# EAGLE design Addon-mapleCUx_Raspi-3V3-UART-Adapter-008 (EAGLE 7.6.0)
MAPLE-CUx Large Version
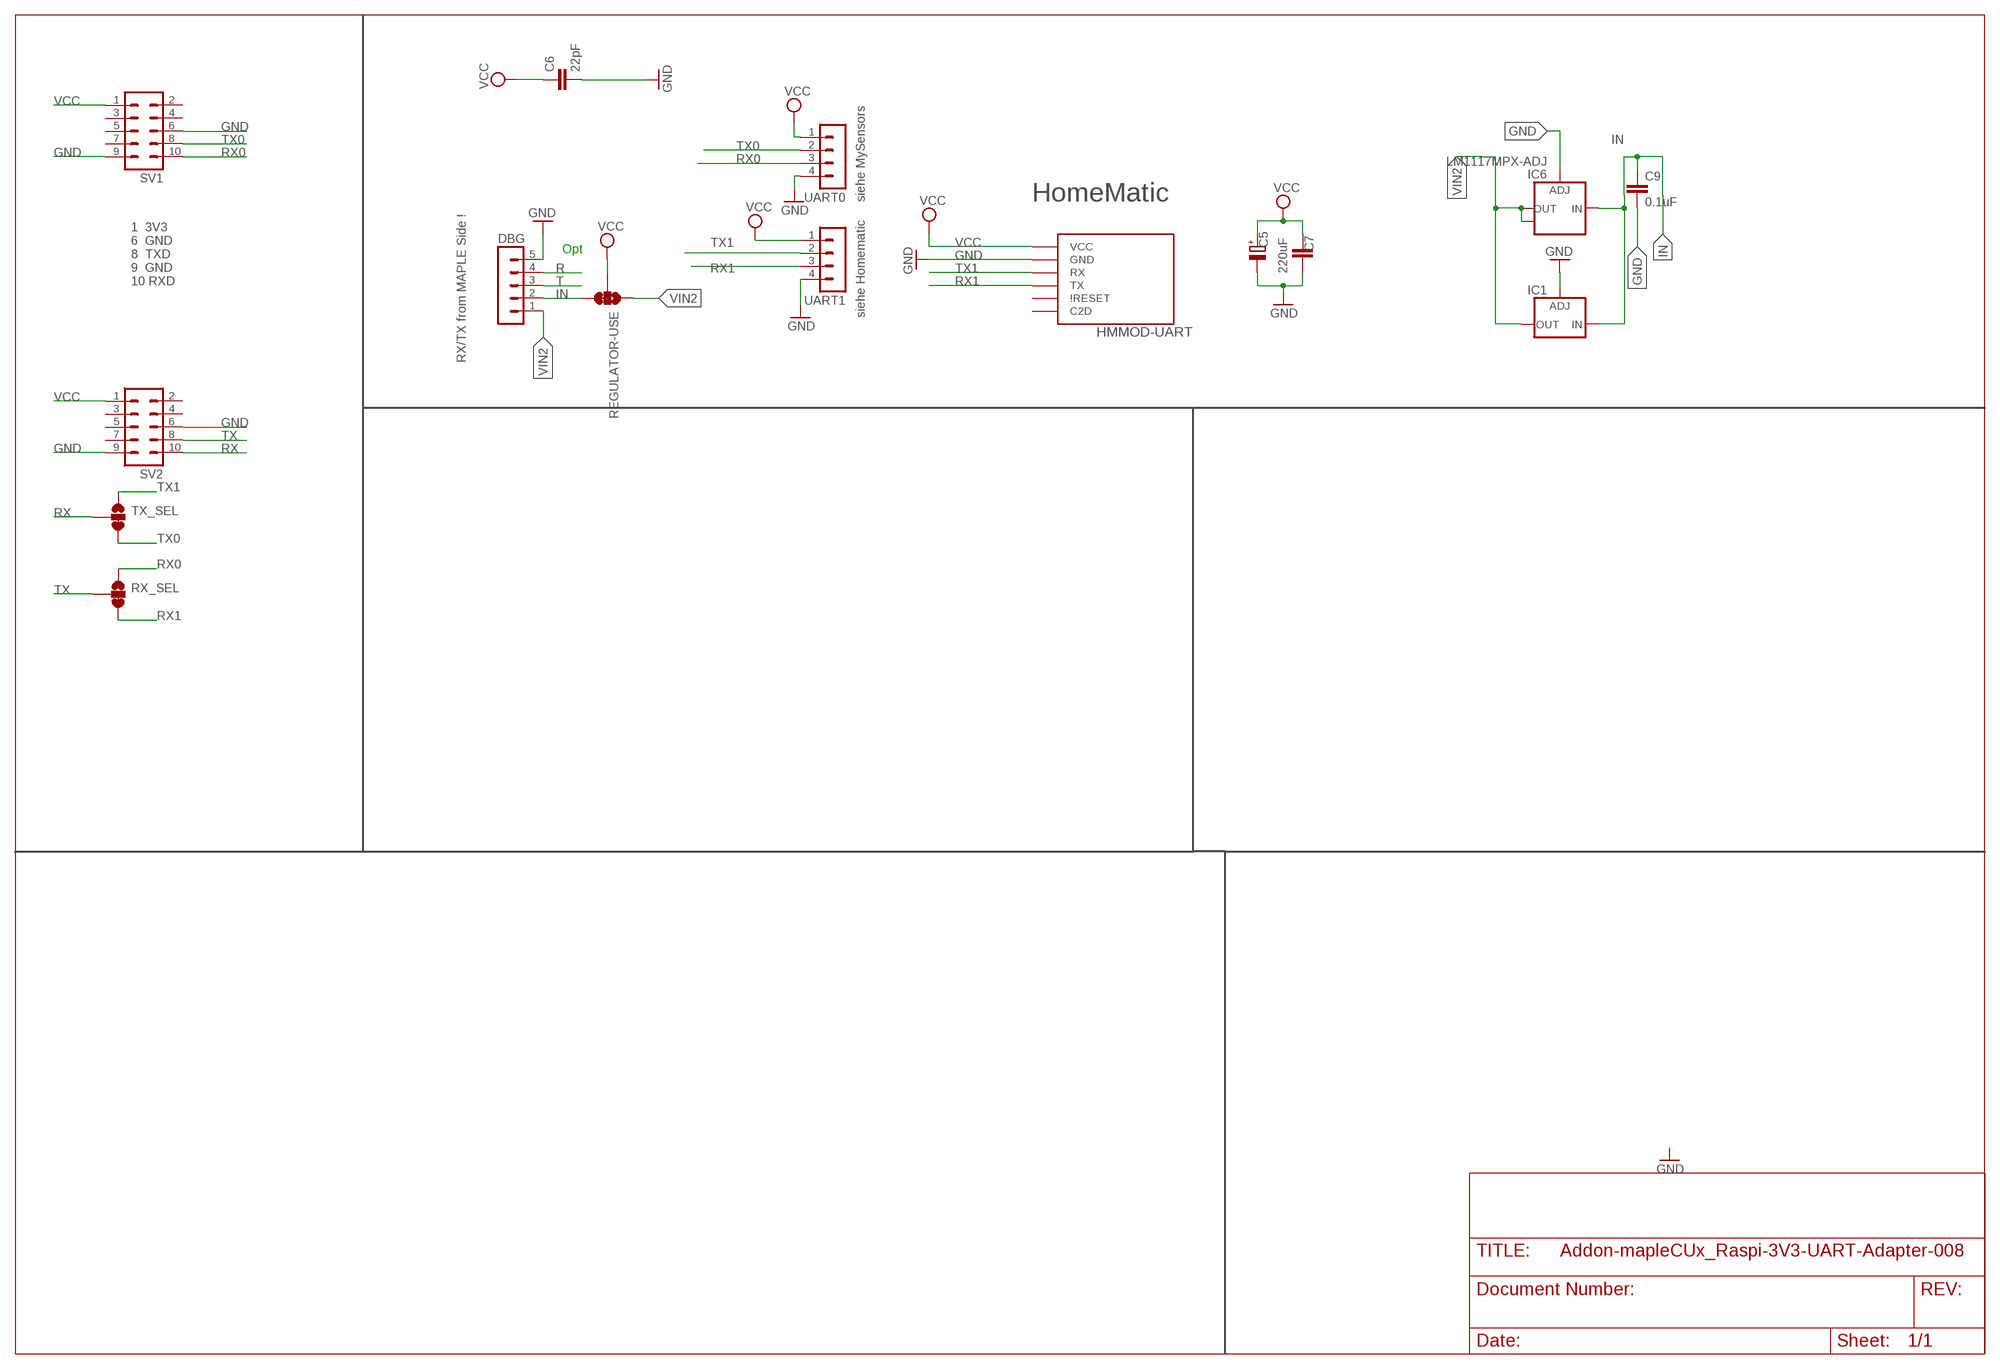
[diagram p0: schematic, sheet 1]

## Parts
C5  220uF  CPOL-EUE5-8.5  [E5-8,5]
C6  22pF  C-EUC0805  [C0805]
C7  C-EUC1812  [C1812]
C9  0.1uF  C-EUC1206  [C1206]
DBG  MA05-1  [MA05-1]
HMMOD-UART  HM-MOD-UARTDIL  [HM-MOD-UART-DIL]
IC1  LD117ADT50TR  [DPACK]
IC6  LM1117MPX-ADJ  [SOT223]
REGULATOR-USE  JUMPER-SMT_3_1-NC_TRACE_SILK  [SMT-JUMPER_3_1-NC_TRACE_SILK]
RX_SEL  JUMPER-SMT_3_1-NC_TRACE_SILK  [SMT-JUMPER_3_1-NC_TRACE_SILK]
SV1  MA05-2  [MA05-2]
SV2  MA05-2  [MA05-2]
TX_SEL  JUMPER-SMT_3_1-NC_TRACE_SILK  [SMT-JUMPER_3_1-NC_TRACE_SILK]
UART0  MA04-1  [MA04-1]
UART1  MA04-1  [MA04-1]

## Nets
GND [PWR]: C5.- C6.2 C7.1 C9.2 DBG.5 HMMOD-UART.2(GND) IC1.1(ADJ) IC6.1(ADJ) SV1.6 SV1.9 SV2.6 SV2.9 UART0.4 UART1.4
IN [PWR]: C9.1 DBG.2 IC1.3(IN) IC6.3(IN) REGULATOR-USE.3
R: DBG.4
RX: SV2.10 TX_SEL.2
RX0: RX_SEL.1 SV1.10 UART0.3
RX1: HMMOD-UART.5(TX) RX_SEL.3 UART1.3
T: DBG.3
TX: RX_SEL.2 SV2.8
TX0: SV1.8 TX_SEL.3 UART0.2
TX1: HMMOD-UART.6(RX) TX_SEL.1 UART1.2
VCC [PWR]: C5.+ C6.1 C7.2 HMMOD-UART.1(VCC) REGULATOR-USE.2 SV1.1 SV2.1 UART0.1 UART1.1
VIN2 [PWR]: DBG.1 IC1.4(OUT) IC6.2(OUT) IC6.TAB(OUT1) REGULATOR-USE.1
Unconnected: HMMOD-UART.3(C2D) HMMOD-UART.4(\!RESET) SV1.2 SV1.3 SV1.4 SV1.5 SV1.7 SV2.2 SV2.3 SV2.4 SV2.5 SV2.7

## Notes on the sheet
- siehe MySensors | HomeMatic
- Opt
- 1  3V3
  6  GND
  8  TXD
  9  GND
  10 RXD
- siehe Homematic
- RX/TX from MAPLE Side !

## Library data of the parts
C5 = rcl:CPOL-EU: POLARIZED CAPACITOR, European symbol
C6 C7 C9 = rcl:C-EU: CAPACITOR, European symbol
DBG = con-lstb:MA05-1: PIN HEADER; OC_FARNELL: unknown; OC_NEWARK: unknown
HMMOD-UART = wireless:HM-MOD-UART: eQ3 HM-MOD-UART-AW-SH2 wireless module for 868 MHz. DIL version for mounting with pin header (antenna upwards) and SMD variant available (antenna downwards).
IC1 = v-reg:LD117A?*: Low drop fixed and adjustable positive voltage regulators 1 A Source: http://www.st.com/stonline/products/literature/ds/7194/ld1117axx.pdf
IC6 = lm1117:LM1117MPX-ADJ
REGULATOR-USE RX_SEL TX_SEL = SparkFun-Jumpers:JUMPER-SMT_3_1-NC_TRACE: Normally closed trace jumper (1 of 2 connections) This jumper has a trace between two pads so it's normally closed (NC). The other connection is normally open (NO). Use a razor knife to open the connection. For best results follow the IPC guidelines for cutting traces: Cutout at least 0.063 mm (0.005 in). Remove all loose material to clean up the cut area. Seal the cut with an approved epoxy. Reapply solder to reclose the connection, or to close the NO connection.
SV1 SV2 = con-lstb:MA05-2: PIN HEADER; OC_FARNELL: unknown; OC_NEWARK: unknown
UART0 UART1 = con-lstb:MA04-1: PIN HEADER; OC_FARNELL: unknown; OC_NEWARK: unknown

## Net classes
0 default: width 0.508 mm
1 PWR: width 1.524 mm

## Board
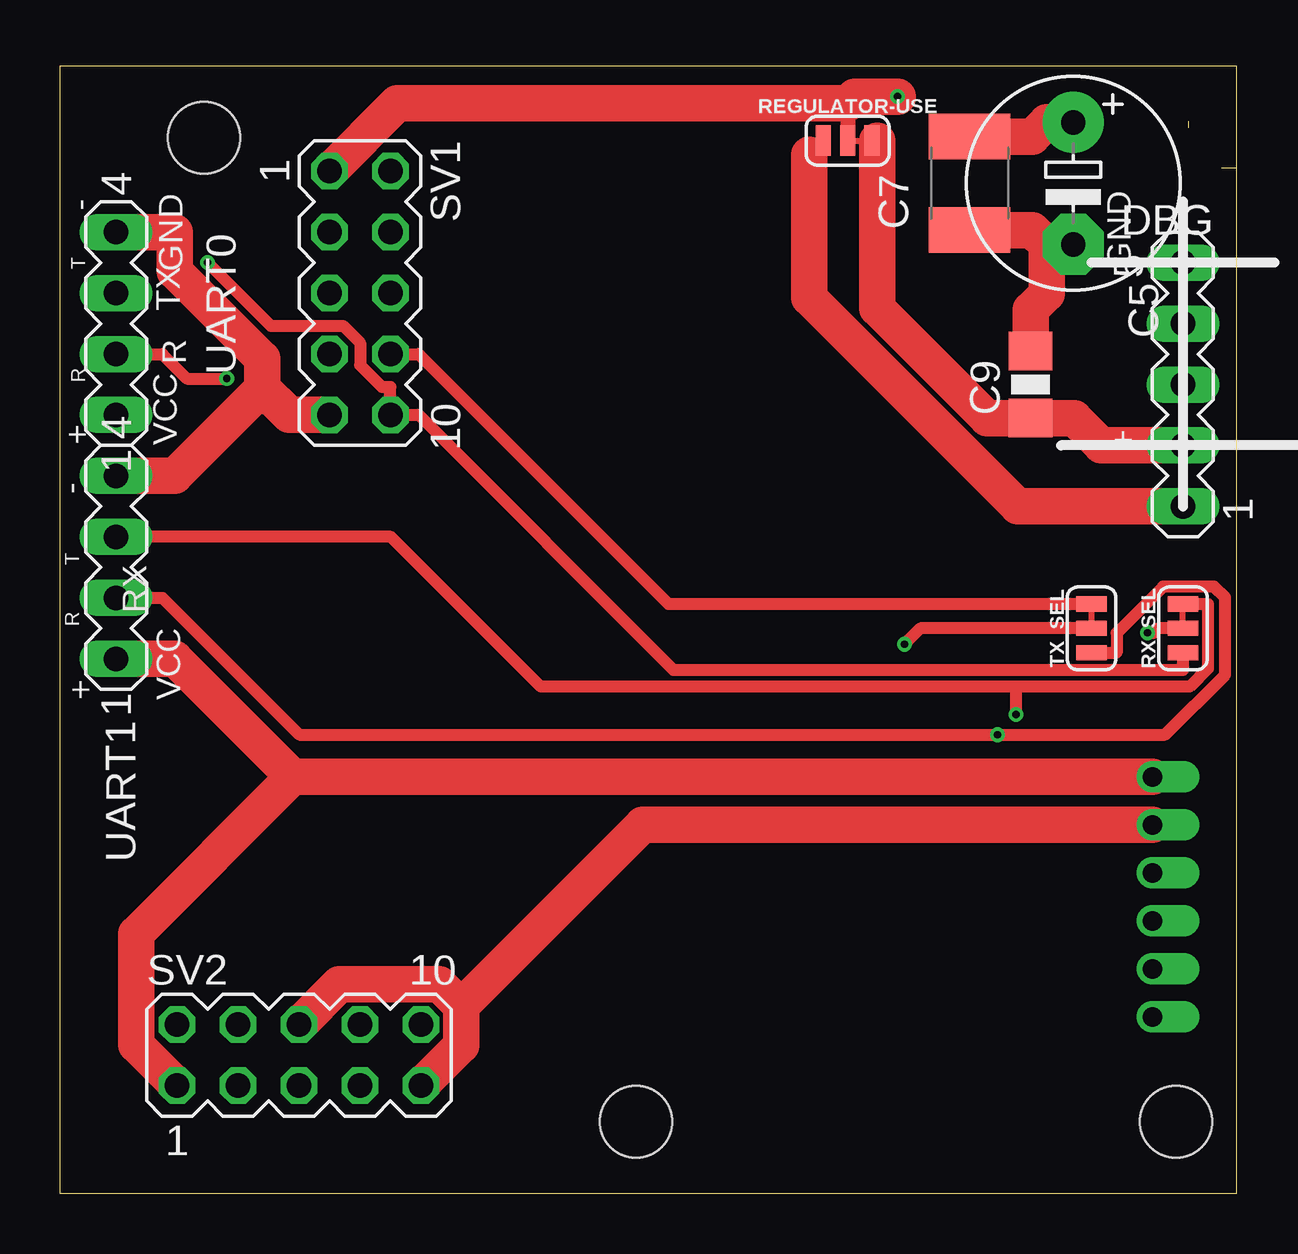
[diagram p1: board, top side]
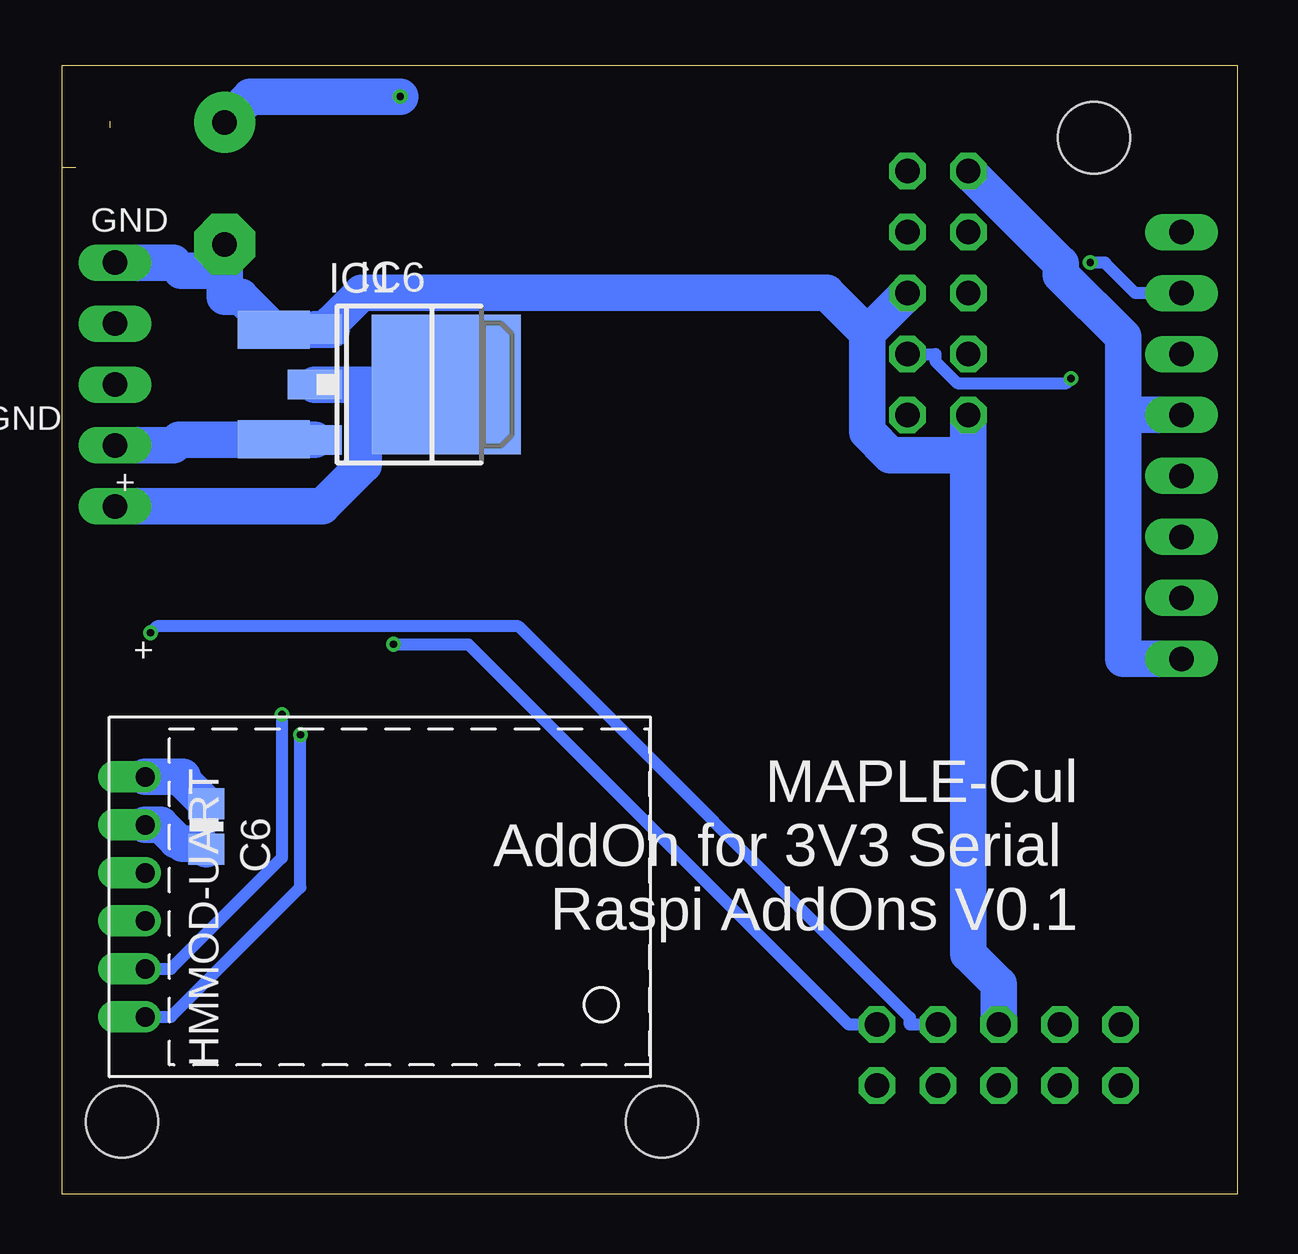
[diagram p2: board, bottom side, seen from below]

Size 49 x 47 mm. Coordinates in mm from the lower left corner, seen from the top.
Outline: 49,47 49,46.24
Outline: 47,44.7 47,44.41
Outline: 48.41,42.75 49,42.75
Outline: 49,47 0,47 0,0 49,0 49,42.75
Outline: 49,47 49,42.75
Copper layers (1*16): Top 0.035mm / dielectric 1.5mm / Bottom 0.035mm
Design rules "SeeedStudio_2layer_DRU_no_angle_20140221": minimum track width 6mil, minimum drill 12mil, track to track 6mil, track to pad 6mil, pad to pad 6mil, via to via 6mil, smd to smd 0mil, copper to edge 10mil, drill to drill 10mil, minimum pad ring 10mil, minimum via ring 6mil, stop-mask expansion 2mil, vias tented up to drill 100mil, thermal gap 10mil
Holes 3 mm at 6,44 24,3 46.5,3
tRestrict: area 0.4,2 to 1.1,47.1
bRestrict: area 0.4,0.7 to 1.1,46.4

### Footprints (pad centres in the part's own frame; a part is rotated, then mirrored left to right if it is on the bottom)
E5-8,5 = drill 1.016 pad 2.54: + -2.54,0 | drill 1.016 pad 2.54 octagon: - 2.54,0
C0805 = smd 1.3 x 1.5: 1 -0.95,0; 2 0.95,0
C1812 = smd 1.9 x 3.4: 1 -1.95,0; 2 1.95,0
C1206 = smd 1.6 x 1.8: 1 -1.4,0; 2 1.4,0
MA05-1 = drill 1.016 long: 1 -5.08,0; 2 -2.54,0; 3 0,0; 4 2.54,0; 5 5.08,0
HM-MOD-UART-DIL = drill 0.8 offset: 1 0,12; 2 0,10; 3 0,8; 4 0,6; 5 0,4; 6 0,2
DPACK = smd 1.6 x 3: 1 -2.28,-4.8; 3 2.28,-4.8 | smd 5.8 x 6.2: 4 0,2.38
SOT223 = smd 1.219 x 2.235: 1 -2.311,-3.099; 2 0,-3.099; 3 2.311,-3.099 | smd 3.6 x 2.2: TAB 0,3.099
SMT-JUMPER_3_1-NC_TRACE_SILK = smd 0.635 x 1.27: 1 -1.016,0; 2 0,0; 3 1.016,0
MA05-2 = drill 1.016 octagon: 1 -5.08,-1.27; 2 -5.08,1.27; 3 -2.54,-1.27; 4 -2.54,1.27; 5 0,-1.27; 6 0,1.27; 7 2.54,-1.27; 8 2.54,1.27; 9 5.08,-1.27; 10 5.08,1.27
MA04-1 = drill 1.016 long: 1 -3.81,0; 2 -1.27,0; 3 1.27,0; 4 3.81,0

### Placement (x,y rotation side)
C5  42.22,42.1 270 top
C6  42.98,15.3 270 bottom
C7  37.9,42.1 90 top
C9  40.44,33.72 90 top
DBG  46.79,33.72 90 top
HMMOD-UART  45.52,5.37 0 bottom
IC1  35.36,33.72 270 bottom
IC6  35.36,33.72 270 bottom
REGULATOR-USE  32.82,43.88 0 top
RX_SEL  46.79,23.56 90 top
SV1  12.5,37.53 270 top
SV2  9.96,5.78 0 top
TX_SEL  42.98,23.56 90 top
UART0  2.34,36.26 90 top
UART1  2.34,26.1 90 top

### Tracks (layer width: path | path; a pad name or v marks a point on that pad's centre or on a via)
GND
  Top 1.524: 8.44,33.57 8.44,34.79 4.78,38.45 4.78,40.07 UART0.4 | C9.2 40.44,36.83 41.11,37.5 41.11,39.56 | 41.11,39.56 40.51,40.15 C7.1 | C5.- 41.11,39.56 | 8.44,33.57 4.78,29.91 UART1.4 | 8.44,33.57 9.55,32.45 SV1.9 | 16.72,7.81 16.72,6.19 SV2.9 | SV2.6 11.64,8.73 15.81,8.73 16.72,7.81 | 16.72,7.81 24.28,15.37 HMMOD-UART.2
  Bottom 1.308: 43.95,14.58 44.1,14.73 44.24,14.73
  Bottom 1.524: 43.95,14.58 43.2,14.58 C6.2 | HMMOD-UART.2 44.88,15.37 44.24,14.73 | DBG.5 44.35,38.8 44.02,38.47 42.22,38.47 | 42.22,38.47 42.22,37.38 41.54,37.38 IC1.1 37.75,36 37.75,36.03 | C5.- 42.22,38.47 | 15.45,35.85 17.13,37.53 36.51,37.53 37.75,36.3 37.75,36.03 | IC6.1 37.75,36.03 | 15.45,35.85 15.45,31.74 14.48,30.77 11.23,30.77 | SV1.6 15.45,35.85 | SV2.6 9.96,8.73 11.23,10 11.23,30.77 | SV1.9 11.23,30.77
IN
  Top 0.635: 34.05,43.88 REGULATOR-USE.3
  Top 1.524: 34.05,43.88 34.05,36.89 38.63,32.32 C9.1 42.25,32.32 43.39,31.18 DBG.2
  Bottom 1.524: 40.16,31.42 44.11,31.42 44.35,31.18 DBG.2 | IC6.3 40.14,31.41 40.16,31.42 | 40.16,31.42 IC1.3
RX  (via drill 0.3 pad 0.61)
  Top 0.508: TX_SEL.2 35.84,23.56 v35.18,22.9
  Bottom 0.508: SV2.10 16.21,7.05 32.06,22.9 v35.18,22.9
RX0  (via drill 0.3 pad 0.61)
  Top 0.508: v6.15,38.8 8.79,36.16 11.8,36.16 12.5,35.45 12.5,34.52 13.41,33.62 13.77,33.62 SV1.10 14.94,32.45 25.57,21.82 46.79,21.82 RX_SEL.1
  Bottom 0.508: UART0.3 4.27,37.53 5.54,38.8 v6.15,38.8
RX1  (via drill 0.3 pad 0.61)
  Top 0.508: 39.83,21.13 20.03,21.13 13.79,27.37 UART1.3 | 39.83,21.13 47.07,21.13 47.83,21.89 47.83,24.58 RX_SEL.3 | 39.83,21.13 v39.83,19.97
  Bottom 0.508: HMMOD-UART.5 44.46,9.37 39.83,14 v39.83,19.97
TX  (via drill 0.3 pad 0.61)
  Top 0.508: RX_SEL.2 45.75,23.56 45.56,23.38 v45.31,23.38
  Bottom 0.508: SV2.8 13.67,7.05 13.67,7.34 29.97,23.64 45.04,23.64 v45.31,23.38
TX0  (via drill 0.3 pad 0.61)
  Top 0.508: SV1.8 14.94,34.99 25.35,24.58 TX_SEL.3 | v6.95,33.97 5.29,33.97 4.27,34.99 UART0.2
  Bottom 0.508: SV1.8 12.6,34.99 12.6,34.7 11.69,33.78 7.14,33.78 v6.95,33.97
TX1  (via drill 0.3 pad 0.61)
  Top 0.508: TX_SEL.1 44.02,22.54 44.02,23.36 45.96,25.3 48.08,25.3 48.54,24.84 48.54,21.63 46.04,19.13 v39.06,19.13 9.97,19.13 4.27,24.83 UART1.2
  Bottom 0.508: v39.06,19.13 39.06,12.77 44.46,7.37 HMMOD-UART.6
VCC  (via drill 0.3 pad 0.61)
  Top 0.635: 32.82,45.43 REGULATOR-USE.2
  Top 1.524: SV1.1 14.05,45.43 32.82,45.43 33.11,45.72 v34.9,45.72 | 9.7,17.37 HMMOD-UART.1 | 9.7,17.37 4.78,22.29 UART1.1 | 9.7,17.37 3.17,10.84 3.17,6.22 SV2.1 | C7.2 40.51,44.05 41.11,44.64 C5.+
  Bottom 1.524: v34.9,45.72 41.14,45.72 C5.+ | 4.78,32.45 4.78,35.71 7.37,38.3 7.37,38.75 SV1.1 | UART1.1 4.78,22.29 4.78,32.45 | UART0.1 4.78,32.45 | HMMOD-UART.1 43.95,17.37 43.95,17.23 C6.1
VIN2
  Top 0.635: 31.21,43.28 REGULATOR-USE.1
  Top 1.524: 31.21,43.28 31.21,37.34 39.91,28.64 DBG.1
  Bottom 1.524: 36.43,33.72 IC1.4 IC6.TAB | IC6.2 36.43,33.72 | DBG.1 38.16,28.64 36.43,30.37 36.43,33.72

### Text on the board
tNames: GND | - | T | GND | TX | R | R | + | VCC | + | - | T | R | RX | VCC | +
bNames: GND | GND | + | + | MAPLE-Cul / AddOn for 3V3 Serial / Raspi AddOns V0.1